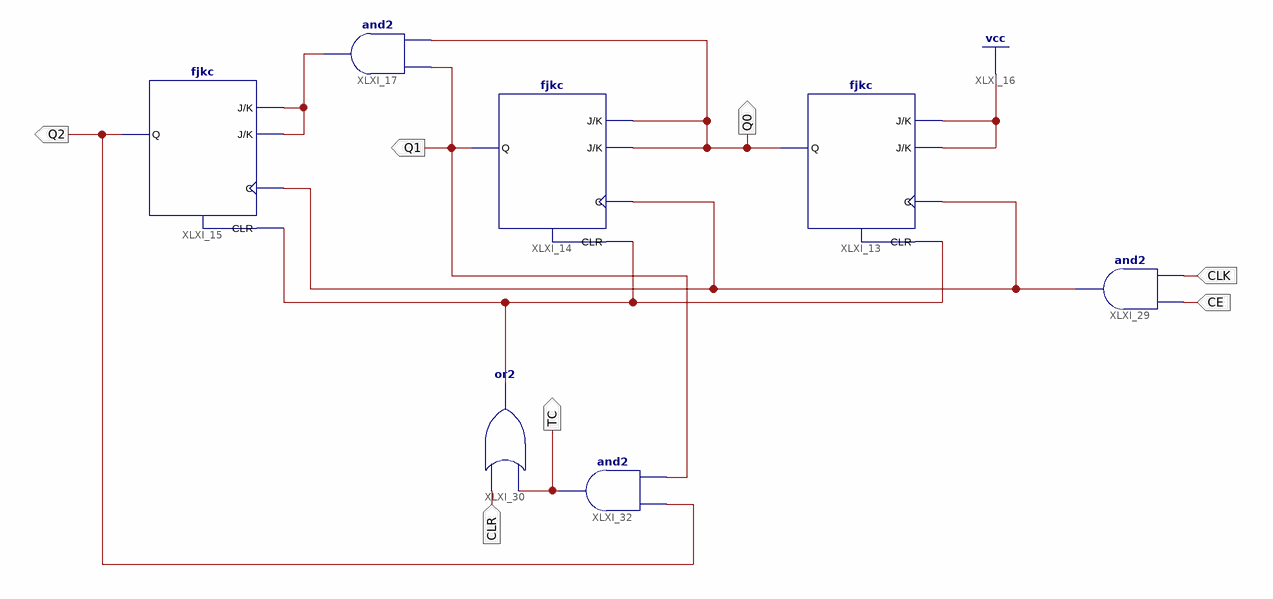
[diagram p0: schematic sheet 1]
// Xilinx ISE schematic Counter0_5.sch (spartan6) as structural Verilog: 7 symbols, 7 ports
module Counter0_5 (
  input  CLK,
  input  CE,
  input  CLR,
  output Q0,
  output Q1,
  output TC,
  output Q2
);

  wire XLXN_26, XLXN_30, XLXN_33;

  fjkc XLXI_13 (.C(XLXN_30), .CLR(XLXN_33), .J(1'b1), .K(1'b1), .Q(Q0));
  fjkc XLXI_14 (.C(XLXN_30), .CLR(XLXN_33), .J(Q0), .K(Q0), .Q(Q1));
  fjkc XLXI_15 (.C(XLXN_30), .CLR(XLXN_33), .J(XLXN_26), .K(XLXN_26), .Q(Q2));
  and XLXI_17 (XLXN_26, Q0, Q1);
  and XLXI_29 (XLXN_30, CLK, CE);
  or XLXI_30 (XLXN_33, TC, CLR);
  and XLXI_32 (TC, Q1, Q2);
endmodule
